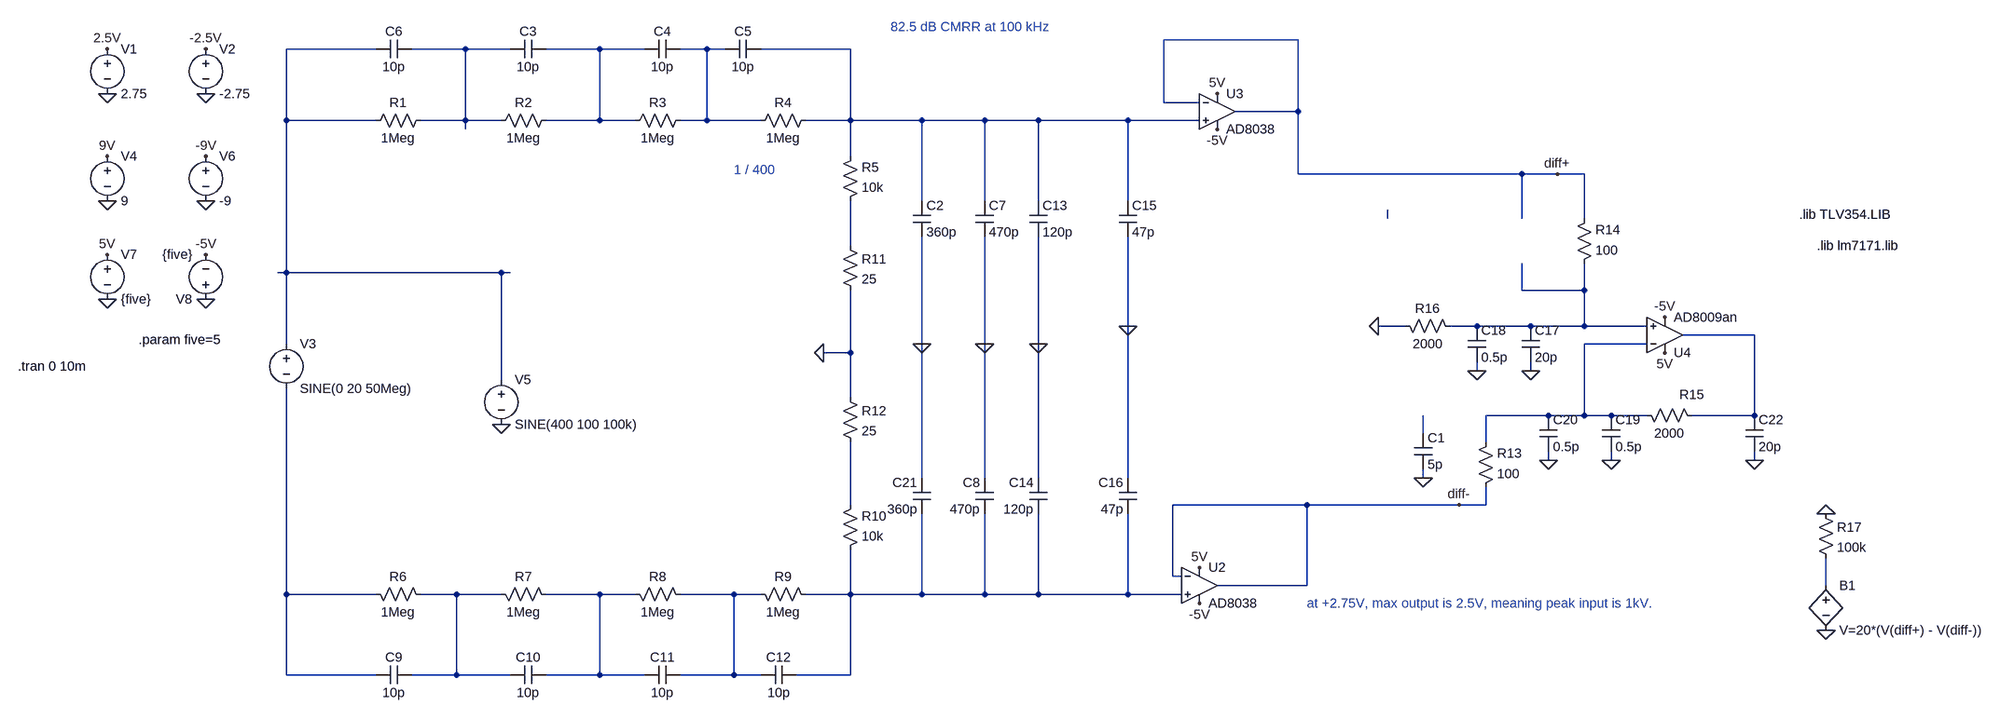
[diagram p0: schematic 000_init.asc]
000_init.asc, the LTspice schematic file:
Version 4
SHEET 1 3776 1588
WIRE 2048 -272 1808 -272
WIRE 400 -256 240 -256
WIRE 560 -256 464 -256
WIRE 640 -256 560 -256
WIRE 800 -256 704 -256
WIRE 880 -256 800 -256
WIRE 992 -256 944 -256
WIRE 1024 -256 992 -256
WIRE 1248 -256 1088 -256
WIRE 1808 -160 1808 -272
WIRE 1872 -160 1808 -160
WIRE 2048 -144 2048 -272
WIRE 2048 -144 1936 -144
WIRE 240 -128 240 -256
WIRE 400 -128 240 -128
WIRE 560 -128 560 -256
WIRE 560 -128 480 -128
WIRE 624 -128 560 -128
WIRE 800 -128 800 -256
WIRE 800 -128 704 -128
WIRE 864 -128 800 -128
WIRE 992 -128 992 -256
WIRE 992 -128 944 -128
WIRE 1088 -128 992 -128
WIRE 1248 -128 1248 -256
WIRE 1248 -128 1168 -128
WIRE 1376 -128 1248 -128
WIRE 1488 -128 1376 -128
WIRE 1584 -128 1488 -128
WIRE 1744 -128 1584 -128
WIRE 1872 -128 1744 -128
WIRE 560 -112 560 -128
WIRE 1248 -64 1248 -128
WIRE 2048 -32 2048 -144
WIRE 2448 -32 2048 -32
WIRE 2512 -32 2448 -32
WIRE 2560 -32 2512 -32
WIRE 1376 16 1376 -128
WIRE 1488 16 1488 -128
WIRE 1584 16 1584 -128
WIRE 1744 16 1744 -128
WIRE 2208 48 2208 32
WIRE 2448 48 2448 -32
WIRE 2560 48 2560 -32
WIRE 1248 96 1248 16
WIRE 240 144 240 -128
WIRE 240 144 224 144
WIRE 624 144 240 144
WIRE 640 144 624 144
WIRE 2448 176 2448 128
WIRE 2560 176 2560 128
WIRE 2560 176 2448 176
WIRE 1744 240 1744 80
WIRE 2240 240 2192 240
WIRE 2368 240 2320 240
WIRE 2464 240 2368 240
WIRE 2560 240 2560 176
WIRE 2560 240 2464 240
WIRE 2672 240 2560 240
WIRE 2864 256 2736 256
WIRE 240 272 240 144
WIRE 1376 272 1376 80
WIRE 1488 272 1488 80
WIRE 1584 272 1584 80
WIRE 2672 272 2560 272
WIRE 1248 288 1248 176
WIRE 1248 288 1200 288
WIRE 2368 320 2368 304
WIRE 2464 320 2464 304
WIRE 624 336 624 144
WIRE 1248 368 1248 288
WIRE 2496 400 2384 400
WIRE 2560 400 2560 272
WIRE 2560 400 2496 400
WIRE 2608 400 2560 400
WIRE 2672 400 2608 400
WIRE 2864 400 2864 256
WIRE 2864 400 2752 400
WIRE 2272 432 2272 400
WIRE 2384 448 2384 400
WIRE 2496 480 2496 464
WIRE 2608 480 2608 464
WIRE 2864 480 2864 464
WIRE 1376 512 1376 272
WIRE 1488 512 1488 272
WIRE 1584 512 1584 272
WIRE 1744 512 1744 240
WIRE 2272 512 2272 496
WIRE 1248 560 1248 448
WIRE 2064 560 1824 560
WIRE 2336 560 2064 560
WIRE 2384 560 2384 528
WIRE 2384 560 2336 560
WIRE 1824 688 1824 560
WIRE 1840 688 1824 688
WIRE 2064 704 2064 560
WIRE 2064 704 1904 704
WIRE 2992 704 2992 656
WIRE 240 720 240 352
WIRE 400 720 240 720
WIRE 544 720 480 720
WIRE 624 720 544 720
WIRE 800 720 704 720
WIRE 864 720 800 720
WIRE 1040 720 944 720
WIRE 1088 720 1040 720
WIRE 1248 720 1248 640
WIRE 1248 720 1168 720
WIRE 1376 720 1376 576
WIRE 1376 720 1248 720
WIRE 1488 720 1488 576
WIRE 1488 720 1376 720
WIRE 1584 720 1584 576
WIRE 1584 720 1488 720
WIRE 1744 720 1744 576
WIRE 1744 720 1584 720
WIRE 1840 720 1744 720
WIRE 240 864 240 720
WIRE 400 864 240 864
WIRE 544 864 544 720
WIRE 544 864 464 864
WIRE 640 864 544 864
WIRE 800 864 800 720
WIRE 800 864 704 864
WIRE 880 864 800 864
WIRE 1040 864 1040 720
WIRE 1040 864 944 864
WIRE 1088 864 1040 864
WIRE 1248 864 1248 720
WIRE 1248 864 1152 864
FLAG -80 -176 0
FLAG -80 -256 2.5V
FLAG 96 -176 0
FLAG 96 -256 -2.5V
FLAG 1200 288 0
FLAG 1584 272 0
FLAG 1744 240 0
FLAG 1904 -176 5V
FLAG 1904 -112 -5V
FLAG 624 416 0
FLAG 1488 272 0
FLAG -80 16 0
FLAG -80 -64 9V
FLAG 96 16 0
FLAG 96 -64 -9V
FLAG 2192 240 0
FLAG -80 192 0
FLAG -80 112 5V
FLAG 96 192 0
FLAG 1872 672 5V
FLAG 1872 736 -5V
FLAG 2704 288 5V
FLAG 2704 224 -5V
FLAG 96 112 -5V
FLAG 2512 -32 diff+
FLAG 2336 560 diff-
FLAG 2992 784 0
FLAG 2992 576 0
FLAG 2272 512 0
FLAG 2464 320 0
FLAG 2368 320 0
FLAG 2608 480 0
FLAG 2496 480 0
FLAG 2864 480 0
FLAG 1376 272 0
SYMBOL voltage -80 -272 R0
SYMATTR InstName V1
SYMATTR Value 2.75
SYMBOL voltage 96 -272 R0
SYMATTR InstName V2
SYMATTR Value -2.75
SYMBOL voltage 240 256 R0
WINDOW 123 0 0 Left 0
WINDOW 39 0 0 Left 0
SYMATTR InstName V3
SYMATTR Value SINE(0 20 50Meg)
SYMBOL res 496 -144 R90
WINDOW 0 0 56 VBottom 2
WINDOW 3 32 56 VTop 2
SYMATTR InstName R1
SYMATTR Value 1Meg
SYMBOL res 720 -144 R90
WINDOW 0 0 56 VBottom 2
WINDOW 3 32 56 VTop 2
SYMATTR InstName R2
SYMATTR Value 1Meg
SYMBOL res 960 -144 R90
WINDOW 0 0 56 VBottom 2
WINDOW 3 32 56 VTop 2
SYMATTR InstName R3
SYMATTR Value 1Meg
SYMBOL res 1184 -144 R90
WINDOW 0 0 56 VBottom 2
WINDOW 3 32 56 VTop 2
SYMATTR InstName R4
SYMATTR Value 1Meg
SYMBOL res 496 736 M270
WINDOW 0 32 56 VTop 2
WINDOW 3 0 56 VBottom 2
SYMATTR InstName R6
SYMATTR Value 1Meg
SYMBOL res 720 736 M270
WINDOW 0 32 56 VTop 2
WINDOW 3 0 56 VBottom 2
SYMATTR InstName R7
SYMATTR Value 1Meg
SYMBOL res 960 736 M270
WINDOW 0 32 56 VTop 2
WINDOW 3 0 56 VBottom 2
SYMATTR InstName R8
SYMATTR Value 1Meg
SYMBOL res 1184 736 M270
WINDOW 0 32 56 VTop 2
WINDOW 3 0 56 VBottom 2
SYMATTR InstName R9
SYMATTR Value 1Meg
SYMBOL res 1232 656 M180
WINDOW 0 36 76 Left 2
WINDOW 3 36 40 Left 2
SYMATTR InstName R10
SYMATTR Value 10k
SYMBOL cap 464 -272 R90
WINDOW 0 0 32 VBottom 2
WINDOW 3 32 32 VTop 2
SYMATTR InstName C6
SYMATTR Value 10p
SYMBOL cap 704 -272 R90
WINDOW 0 0 32 VBottom 2
WINDOW 3 32 32 VTop 2
SYMATTR InstName C3
SYMATTR Value 10p
SYMBOL cap 944 -272 R90
WINDOW 0 0 32 VBottom 2
WINDOW 3 32 32 VTop 2
SYMATTR InstName C4
SYMATTR Value 10p
SYMBOL cap 1088 -272 R90
WINDOW 0 0 32 VBottom 2
WINDOW 3 32 32 VTop 2
SYMATTR InstName C5
SYMATTR Value 10p
SYMBOL cap 464 848 R90
WINDOW 0 0 32 VBottom 2
WINDOW 3 32 32 VTop 2
SYMATTR InstName C9
SYMATTR Value 10p
SYMBOL cap 704 848 R90
WINDOW 0 0 32 VBottom 2
WINDOW 3 32 32 VTop 2
SYMATTR InstName C10
SYMATTR Value 10p
SYMBOL cap 944 848 R90
WINDOW 0 0 32 VBottom 2
WINDOW 3 32 32 VTop 2
SYMATTR InstName C11
SYMATTR Value 10p
SYMBOL cap 1152 848 R90
WINDOW 0 0 32 VBottom 2
WINDOW 3 32 32 VTop 2
SYMATTR InstName C12
SYMATTR Value 10p
SYMBOL cap 1568 16 R0
SYMATTR InstName C13
SYMATTR Value 120p
SYMBOL cap 1600 576 R180
WINDOW 0 24 56 Left 2
WINDOW 3 24 8 Left 2
SYMATTR InstName C14
SYMATTR Value 120p
SYMBOL cap 1728 16 R0
SYMATTR InstName C15
SYMATTR Value 47p
SYMBOL cap 1760 576 R180
WINDOW 0 24 56 Left 2
WINDOW 3 24 8 Left 2
SYMATTR InstName C16
SYMATTR Value 47p
SYMBOL res 1232 32 M180
WINDOW 0 36 76 Left 2
WINDOW 3 36 40 Left 2
SYMATTR InstName R5
SYMATTR Value 10k
SYMBOL res 2368 544 M180
WINDOW 0 36 76 Left 2
WINDOW 3 36 40 Left 2
SYMATTR InstName R13
SYMATTR Value 100
SYMBOL res 2544 144 M180
WINDOW 0 36 76 Left 2
WINDOW 3 36 40 Left 2
SYMATTR InstName R14
SYMATTR Value 100
SYMBOL res 2656 384 M90
WINDOW 0 -6 96 VBottom 2
WINDOW 3 32 56 VTop 2
SYMATTR InstName R15
SYMATTR Value 2000
SYMBOL res 2224 224 M90
WINDOW 0 0 56 VBottom 2
WINDOW 3 32 56 VTop 2
SYMATTR InstName R16
SYMATTR Value 2000
SYMBOL voltage 624 320 R0
WINDOW 123 0 0 Left 0
WINDOW 39 0 0 Left 0
SYMATTR InstName V5
SYMATTR Value SINE(400 100 100k)
SYMBOL cap 1472 16 R0
SYMATTR InstName C7
SYMATTR Value 470p
SYMBOL cap 1504 576 R180
WINDOW 0 24 56 Left 2
WINDOW 3 24 8 Left 2
SYMATTR InstName C8
SYMATTR Value 470p
SYMBOL voltage -80 -80 R0
SYMATTR InstName V4
SYMATTR Value 9
SYMBOL voltage 96 -80 R0
SYMATTR InstName V6
SYMATTR Value -9
SYMBOL voltage -80 96 R0
SYMATTR InstName V7
SYMATTR Value {five}
SYMBOL voltage 96 208 R180
WINDOW 123 0 0 Left 0
WINDOW 39 0 0 Left 0
SYMATTR InstName V8
SYMATTR Value {five}
SYMBOL OpAmps\\AD8038 1904 -208 R0
SYMATTR InstName U3
SYMBOL OpAmps\\AD8038 1872 640 R0
SYMATTR InstName U2
SYMBOL ZZZ\\OpAmp\\AD8009an 2704 256 M180
SYMATTR InstName U4
SYMBOL bv 2992 688 R0
SYMATTR InstName B1
SYMATTR Value V=20*(V(diff+) - V(diff-))
SYMBOL res 2976 560 R0
SYMATTR InstName R17
SYMATTR Value 100k
SYMBOL cap 2256 432 R0
SYMATTR InstName C1
SYMATTR Value 5p
SYMBOL cap 2448 240 R0
SYMATTR InstName C17
SYMATTR Value 20p
SYMBOL cap 2352 240 R0
SYMATTR InstName C18
SYMATTR Value 0.5p
SYMBOL cap 2592 400 R0
SYMATTR InstName C19
SYMATTR Value 0.5p
SYMBOL cap 2480 400 R0
SYMATTR InstName C20
SYMATTR Value 0.5p
SYMBOL cap 2848 400 R0
SYMATTR InstName C22
SYMATTR Value 20p
SYMBOL res 1232 80 R0
SYMATTR InstName R11
SYMATTR Value 25
SYMBOL res 1232 352 R0
SYMATTR InstName R12
SYMATTR Value 25
SYMBOL cap 1360 16 R0
SYMATTR InstName C2
SYMATTR Value 360p
SYMBOL cap 1392 576 R180
WINDOW 0 24 56 Left 2
WINDOW 3 24 8 Left 2
SYMATTR InstName C21
SYMATTR Value 360p
TEXT -240 312 Left 2 !.tran 0 10m
TEXT 2944 40 Left 2 !.lib TLV354.LIB
TEXT 2976 96 Left 2 !.lib lm7171.lib
TEXT 1040 -40 Left 2 ;1 / 400
TEXT 2064 736 Left 2 ;at +2.75V, max output is 2.5V, meaning peak input is 1kV.
TEXT -24 264 Left 2 !.param five=5
TEXT 1320 -296 Left 2 ;82.5 dB CMRR at 100 kHz

The netlist it stands for:
* 000_init.asc
V1 2.5V 0 2.75
V2 -2.5V 0 -2.75
V3 N001 N014 SINE(0 20 50Meg)
R1 N002 N001 1Meg
R2 N003 N002 1Meg
R3 N004 N003 1Meg
R4 N005 N004 1Meg
R6 N015 N014 1Meg
R7 N016 N015 1Meg
R8 N017 N016 1Meg
R9 N018 N017 1Meg
R10 N018 N012 10k
C6 N002 N001 10p
C3 N003 N002 10p
C4 N004 N003 10p
C5 N005 N004 10p
C9 N015 N014 10p
C10 N016 N015 10p
C11 N017 N016 10p
C12 N018 N017 10p
C13 N005 0 120p
C14 N018 0 120p
C15 N005 0 47p
C16 N018 0 47p
R5 N007 N005 10k
R13 diff- N010 100
R14 N008 diff+ 100
R15 N010 N009 2000
R16 0 N008 2000
V5 N001 0 SINE(400 100 100k)
C7 N005 0 470p
C8 N018 0 470p
V4 9V 0 9
V6 -9V 0 -9
V7 5V 0 {five}
V8 0 -5V {five}
XU3 N005 diff+ 5V -5V diff+ AD8038  ; pins In+ In- V+ V- OUT
XU2 N018 diff- 5V -5V diff- AD8038  ; pins In+ In- V+ V- OUT
* U4: AD8009an (symbol ZZZ\OpAmp\AD8009an not available, pins judged from their places): In+=N008 In-=N010 V+=5V V-=-5V OUT=N009
B1 N013 0 V=20*(V(diff+) - V(diff-))
R17 0 N013 100k
C1 N011 0 5p
C17 N008 0 20p
C18 N008 0 0.5p
C19 N010 0 0.5p
C20 N010 0 0.5p
C22 N009 0 20p
R11 N007 0 25
R12 0 N012 25
C2 N005 0 360p
C21 N018 0 360p
.tran 0 10m
.lib TLV354.LIB
.lib lm7171.lib
* 1 / 400
* at +2.75V, max output is 2.5V, meaning peak input is 1kV.
.param five=5
* 82.5 dB CMRR at 100 kHz
.backanno
.end